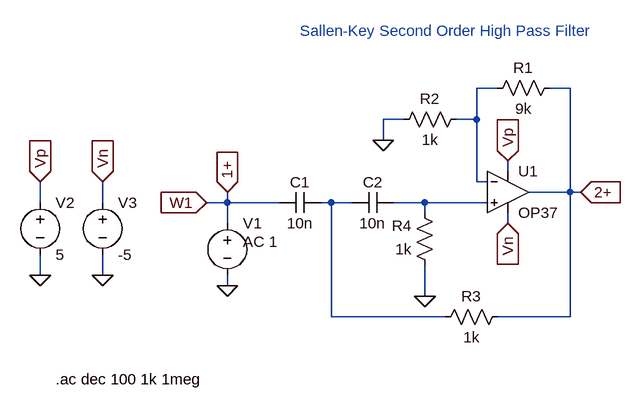
[diagram p0: schematic sk_hpf.asc]
sk_hpf.asc, the LTspice schematic file:
Version 4
SHEET 1 880 680
WIRE 352 -32 320 -32
WIRE 464 -32 432 -32
WIRE 208 16 176 16
WIRE 320 16 320 -32
WIRE 320 16 288 16
WIRE 176 48 176 16
WIRE 368 96 368 80
WIRE 320 112 320 16
WIRE 336 112 320 112
WIRE 464 128 464 -32
WIRE 464 128 400 128
WIRE 480 128 464 128
WIRE -352 144 -352 112
WIRE -256 144 -256 112
WIRE -64 144 -64 128
WIRE -64 144 -96 144
WIRE 16 144 -64 144
WIRE 96 144 80 144
WIRE 128 144 96 144
WIRE 240 144 192 144
WIRE 336 144 240 144
WIRE 240 160 240 144
WIRE -64 176 -64 144
WIRE 368 176 368 160
WIRE -352 256 -352 224
WIRE -256 256 -256 224
WIRE -64 272 -64 256
WIRE 240 288 240 240
WIRE 96 320 96 144
WIRE 272 320 96 320
WIRE 464 320 464 128
WIRE 464 320 352 320
FLAG 368 80 Vp
IOPIN 368 80 In
FLAG 368 176 Vn
IOPIN 368 176 In
FLAG 480 128 2+
IOPIN 480 128 In
FLAG 176 48 0
FLAG -64 272 0
FLAG -96 144 W1
IOPIN -96 144 In
FLAG -64 128 1+
IOPIN -64 128 In
FLAG 240 288 0
FLAG -352 256 0
FLAG -256 256 0
FLAG -352 112 Vp
IOPIN -352 112 In
FLAG -256 112 Vn
IOPIN -256 112 In
SYMBOL Opamps\\OP37 368 64 R0
SYMATTR InstName U1
SYMBOL res 448 -48 R90
WINDOW 0 0 56 VBottom 2
WINDOW 3 32 56 VTop 2
SYMATTR InstName R1
SYMATTR Value 9k
SYMBOL res 304 0 R90
WINDOW 0 0 56 VBottom 2
WINDOW 3 32 56 VTop 2
SYMATTR InstName R2
SYMATTR Value 1k
SYMBOL cap 16 160 R270
WINDOW 0 32 32 VTop 2
WINDOW 3 0 32 VBottom 2
SYMATTR InstName C1
SYMATTR Value 10n
SYMBOL res 368 304 R90
WINDOW 0 0 56 VBottom 2
WINDOW 3 32 56 VTop 2
SYMATTR InstName R3
SYMATTR Value 1k
SYMBOL res 256 256 R180
WINDOW 0 36 76 Left 2
WINDOW 3 36 40 Left 2
SYMATTR InstName R4
SYMATTR Value 1k
SYMBOL voltage -64 160 R0
WINDOW 123 24 44 Left 2
WINDOW 39 0 0 Left 0
SYMATTR Value2 AC 1
SYMATTR InstName V1
SYMATTR Value ""
SYMBOL cap 192 128 R90
WINDOW 0 0 32 VBottom 2
WINDOW 3 32 32 VTop 2
SYMATTR InstName C2
SYMATTR Value 10n
SYMBOL voltage -352 128 R0
WINDOW 123 0 0 Left 0
WINDOW 39 0 0 Left 0
SYMATTR InstName V2
SYMATTR Value 5
SYMBOL voltage -256 128 R0
WINDOW 123 0 0 Left 0
WINDOW 39 0 0 Left 0
SYMATTR InstName V3
SYMATTR Value -5
TEXT -328 416 Left 2 !.ac dec 100 1k 1meg
TEXT 48 -120 Left 2 ;Sallen-Key Second Order High Pass Filter

The netlist it stands for:
* sk_hpf.asc
XU1 N003 N001 Vp Vn 2+ LT1037  ; OP37, pins In+ In- V+ V- OUT
R1 2+ N001 9k
R2 N001 0 1k
C1 1+ N002 10n
R3 2+ N002 1k
R4 0 N003 1k
V1 1+ 0 AC 1
C2 N003 N002 10n
V2 Vp 0 5
V3 Vn 0 -5
.ac dec 100 1k 1meg
* Sallen-Key Second Order High Pass Filter
.lib LTC.lib
.backanno
.end